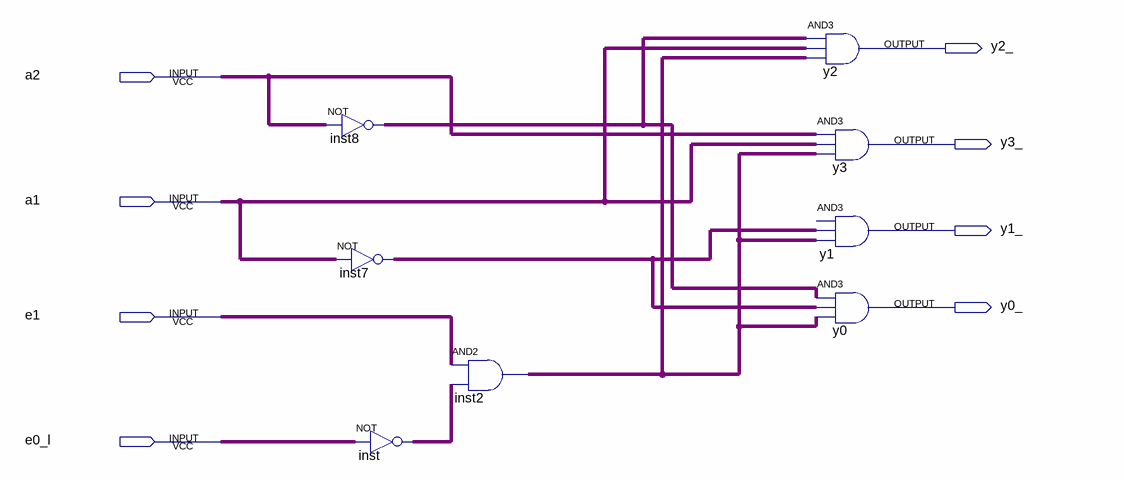
[diagram p0: schematic sheet]
// Quartus schematic 24binarydecoder.bdf as structural Verilog: 8 symbols, 8 pins
module \24binarydecoder  (
  input  a2,
  input  a1,
  input  e1,
  input  e0_l,
  output y2_,
  output y3_,
  output y1_,
  output y0_
);

  wire inst2_out, inst7_out, inst8_out, inst_out;

  not inst8 (inst8_out, a2);
  not inst7 (inst7_out, a1);
  not inst (inst_out, e0_l);
  and inst2 (inst2_out, e1, inst_out);
  and y2 (y2_, inst8_out, a1, inst2_out);
  and y3 (y3_, a2, a1, inst2_out);
  and y1 (y1_, inst7_out, inst2_out);  // open: IN1
  and y0 (y0_, inst8_out, inst7_out, inst2_out);
endmodule
